# EAGLE design NN23_Dual_Src_Optode_00 (EAGLE 7.7.0)
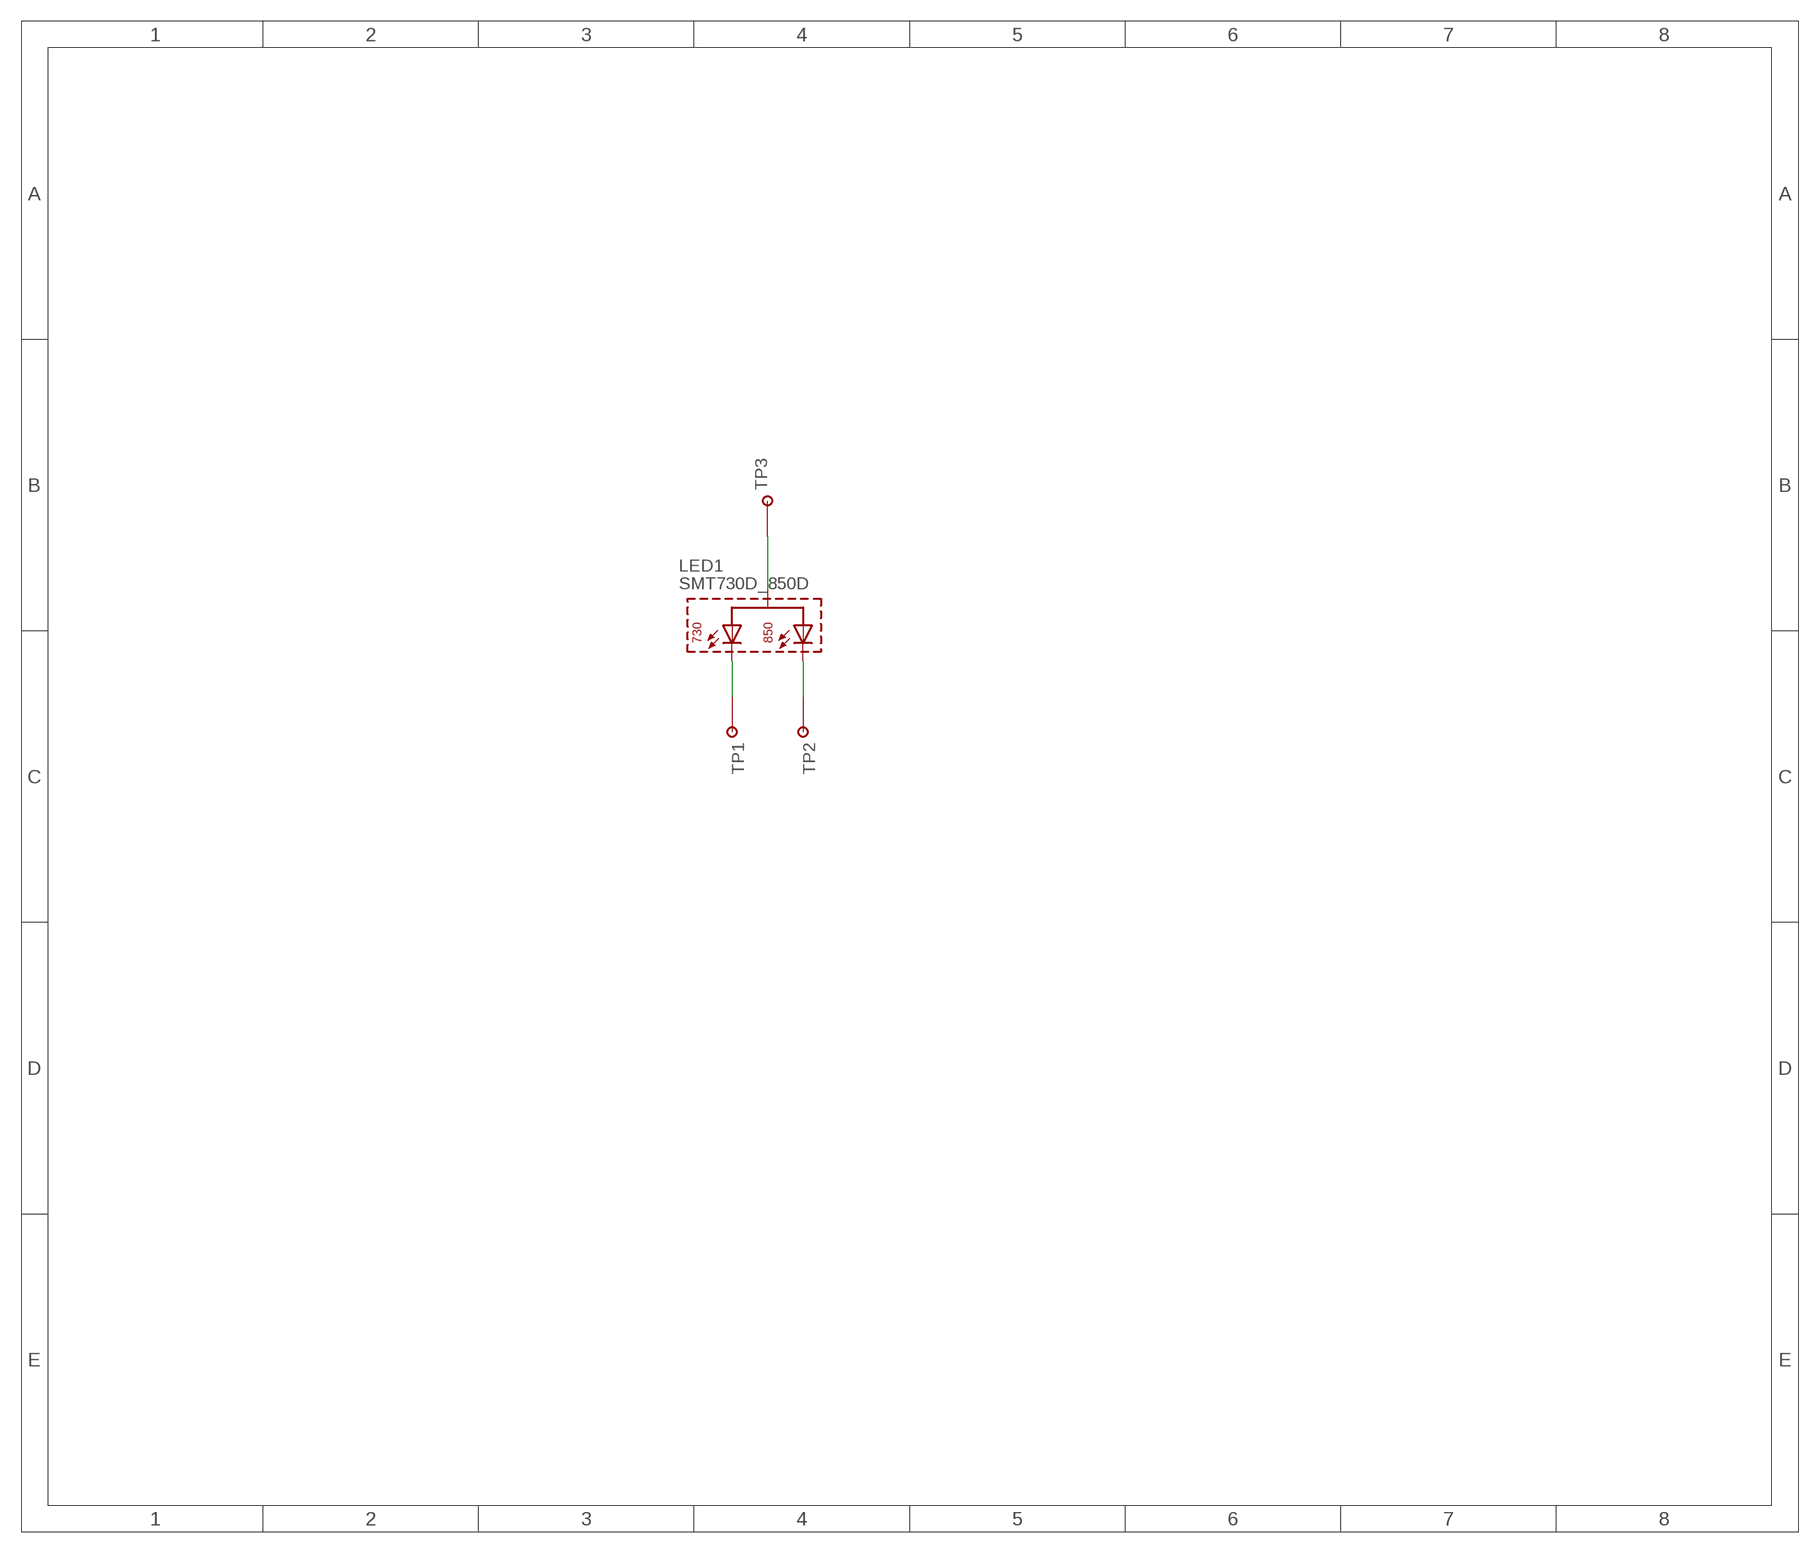
[diagram p0: schematic, sheet 1]

## Parts
LED1  SMT730D_850D  [SMT730D_850D]
TP1  TESTPOINT_PADMEDIUM  [TESTPAD_MEDIUM]
TP2  TESTPOINT_PADMEDIUM  [TESTPAD_MEDIUM]
TP3  TESTPOINT_PADMEDIUM  [TESTPAD_MEDIUM]

## Nets
730: LED1.C7 TP1.P$1
850: LED1.C8 TP2.P$1
AN: LED1.A TP3.P$1

## Library data of the parts
LED1 = MyLib:SMT730D_850D
TP1-TP3 = MyLib:TESTPOINT

## Board
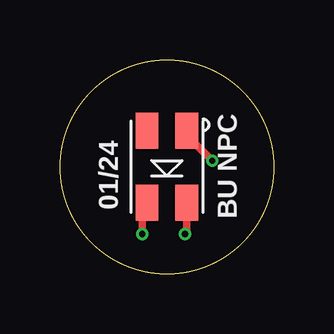
[diagram p1: board, top side]
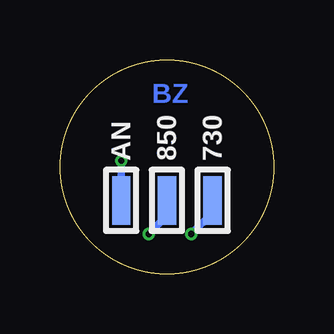
[diagram p2: board, bottom side, seen from below]

Size 8.9 x 8.9 mm. Coordinates in mm from the lower left corner, seen from the top.
Outline: circle at 4.45,4.45 radius 4.45
Copper layers (1*16): Top 0.035559375mm / dielectric 1.6mm / Bottom 0.035559375mm
Design rules "oshpark-2layer *": minimum track width 6mil, minimum drill 10mil, track to track 6mil, track to pad 6mil, pad to pad 6mil, via to via 6mil, smd to smd 6mil, copper to edge 15mil, drill to drill 6mil, minimum pad ring 5mil, minimum via ring 5mil, stop-mask expansion 2.5mil, vias tented up to drill 15mil, thermal gap 10mil

### Footprints (pad centres in the part's own frame; a part is rotated, then mirrored left to right if it is on the bottom)
SMT730D_850D = smd 0.95 x 1.5: A 0.825,1.5; C7 -0.825,-1.5; C8 0.825,-1.5; NC -0.825,1.5
TESTPAD_MEDIUM = smd 2.032 x 0.762: P$1 0,0

### Placement (x,y rotation side)
LED1  4.45,4.45 0 top
TP1  2.54,3.05 90 bottom
TP2  4.45,3.05 90 bottom
TP3  6.35,3.05 90 bottom

### Tracks (layer width: path | path; a pad name or v marks a point on that pad's centre or on a via)
730  (via drill 0.25)
  Top 0.305: v3.43,1.65 3.43,2.75 LED1.C7
  Bottom 0.305: TP1.P$1 2.54,2.54 v3.43,1.65
850  (via drill 0.25)
  Top 0.305: LED1.C8 5.28,1.72 v5.21,1.65
  Bottom 0.305: v5.21,1.65 4.45,2.41 TP2.P$1
AN  (via drill 0.25)
  Top 0.305: LED1.A 5.28,5.77 v6.35,4.7
  Bottom 0.305: TP3.P$1 v6.35,4.7

### Text on the board
Bottom: BZ
tPlace: 01/24 | BU NPC
bPlace: 730 | 850 | AN